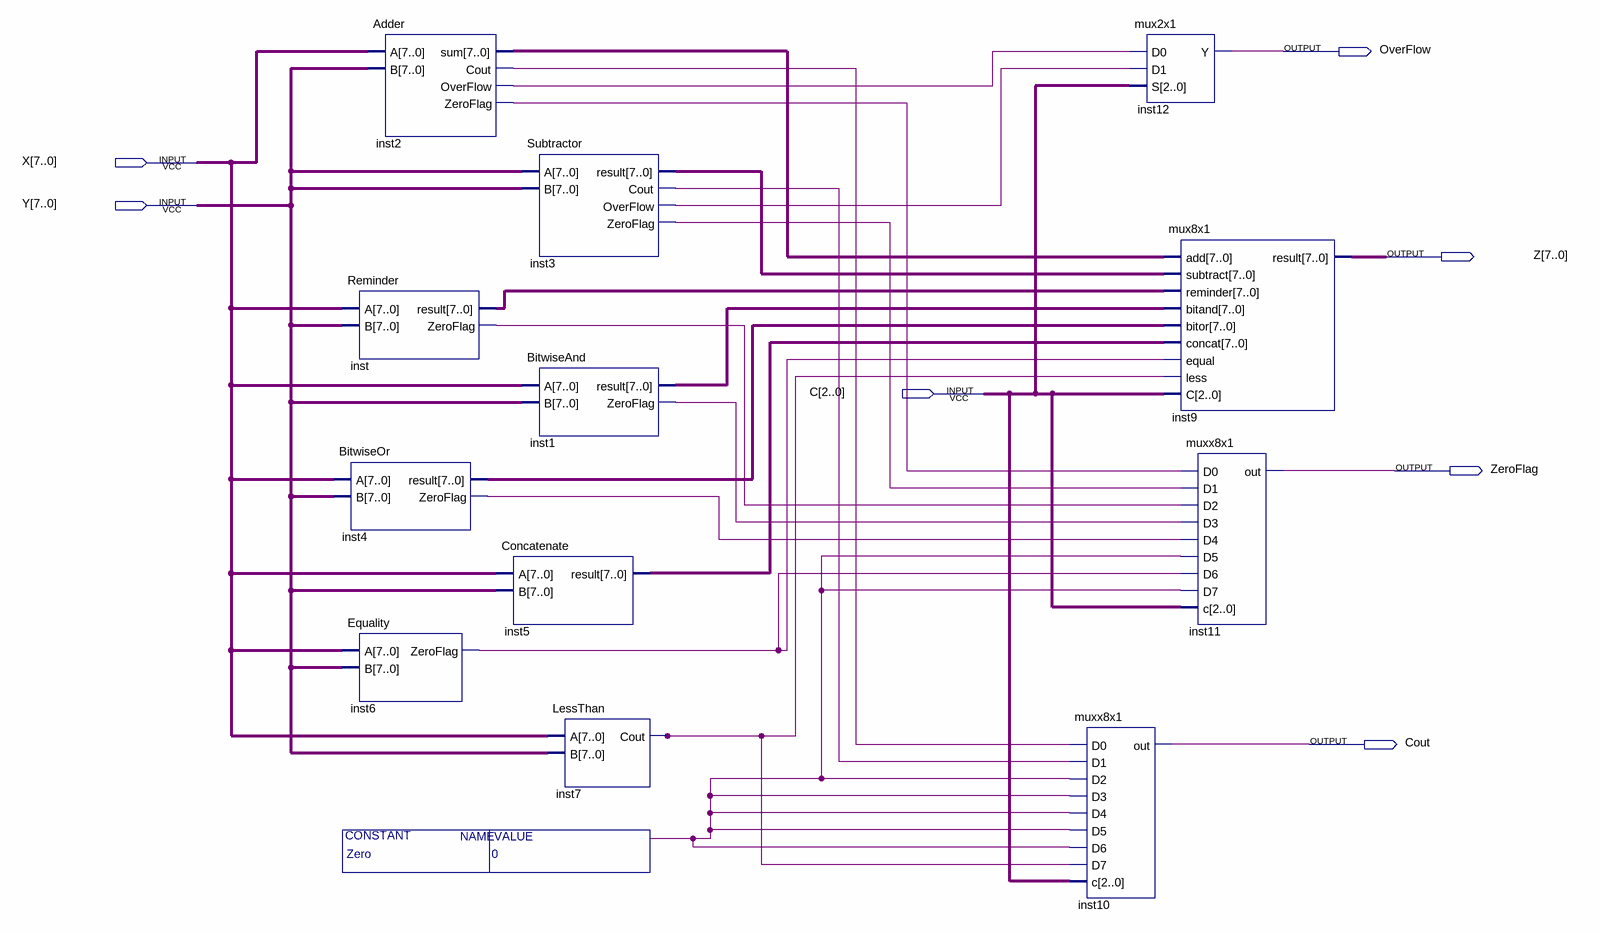
[diagram p0: schematic sheet]
// Quartus schematic ALUsystem.bdf as structural Verilog: 12 symbols, 7 pins
module ALUsystem #(parameter Zero = 0) (
  input  [7:0] X,
  input  [7:0] Y,
  input  [2:0] C,
  output OverFlow,
  output [7:0] Z,
  output ZeroFlag,
  output Cout
);

  wire inst1_zeroflag, inst2_cout, inst2_overflow, inst2_zeroflag, inst3_cout, inst3_overflow,
       inst3_zeroflag, inst4_zeroflag, inst6_zeroflag, inst7_cout, inst_zeroflag, undriven;
  wire [7:0] inst1_result, inst2_sum, inst3_result, inst4_result, inst5_result, inst_result;

  Reminder inst (.A(X), .B(Y), .result(inst_result), .ZeroFlag(inst_zeroflag));
  BitwiseOr inst4 (.A(X), .B(Y), .result(inst4_result), .ZeroFlag(inst4_zeroflag));
  Equality inst6 (.A(X), .B(Y), .ZeroFlag(inst6_zeroflag));
  Adder inst2 (.A(X), .B(Y), .sum(inst2_sum), .Cout(inst2_cout), .OverFlow(inst2_overflow), .ZeroFlag(inst2_zeroflag));
  Subtractor inst3 (
    .A(Y), .B(Y), .result(inst3_result), .Cout(inst3_cout), .OverFlow(inst3_overflow),
    .ZeroFlag(inst3_zeroflag));
  BitwiseAnd inst1 (.A(X), .B(Y), .result(inst1_result), .ZeroFlag(inst1_zeroflag));
  Concatenate inst5 (.A(X), .B(Y), .result(inst5_result));
  LessThan inst7 (.A(X), .B(Y), .Cout(inst7_cout));
  muxx8x1 inst10 (
    .D0(inst2_cout), .D1(inst3_cout), .D2(undriven), .D3(undriven), .D4(undriven), .D5(undriven),
    .D6(undriven), .D7(inst7_cout), .c(C), .out(Cout));
  mux2x1 inst12 (.D0(inst2_overflow), .D1(inst3_overflow), .S(C), .Y(OverFlow));
  mux8x1 inst9 (
    .add(inst2_sum), .subtract(inst3_result), .reminder(inst_result), .bitand(inst1_result),
    .bitor(inst4_result), .concat(inst5_result), .equal(inst6_zeroflag), .less(inst7_cout), .C(C), .result(Z));
  muxx8x1 inst11 (
    .D0(inst2_zeroflag), .D1(inst3_zeroflag), .D2(inst_zeroflag), .D3(inst1_zeroflag), .D4(inst4_zeroflag),
    .D5(undriven), .D6(inst6_zeroflag), .D7(undriven), .c(C), .out(ZeroFlag));
endmodule
